# EAGLE design MIDIme V02 (EAGLE 6.6.0)
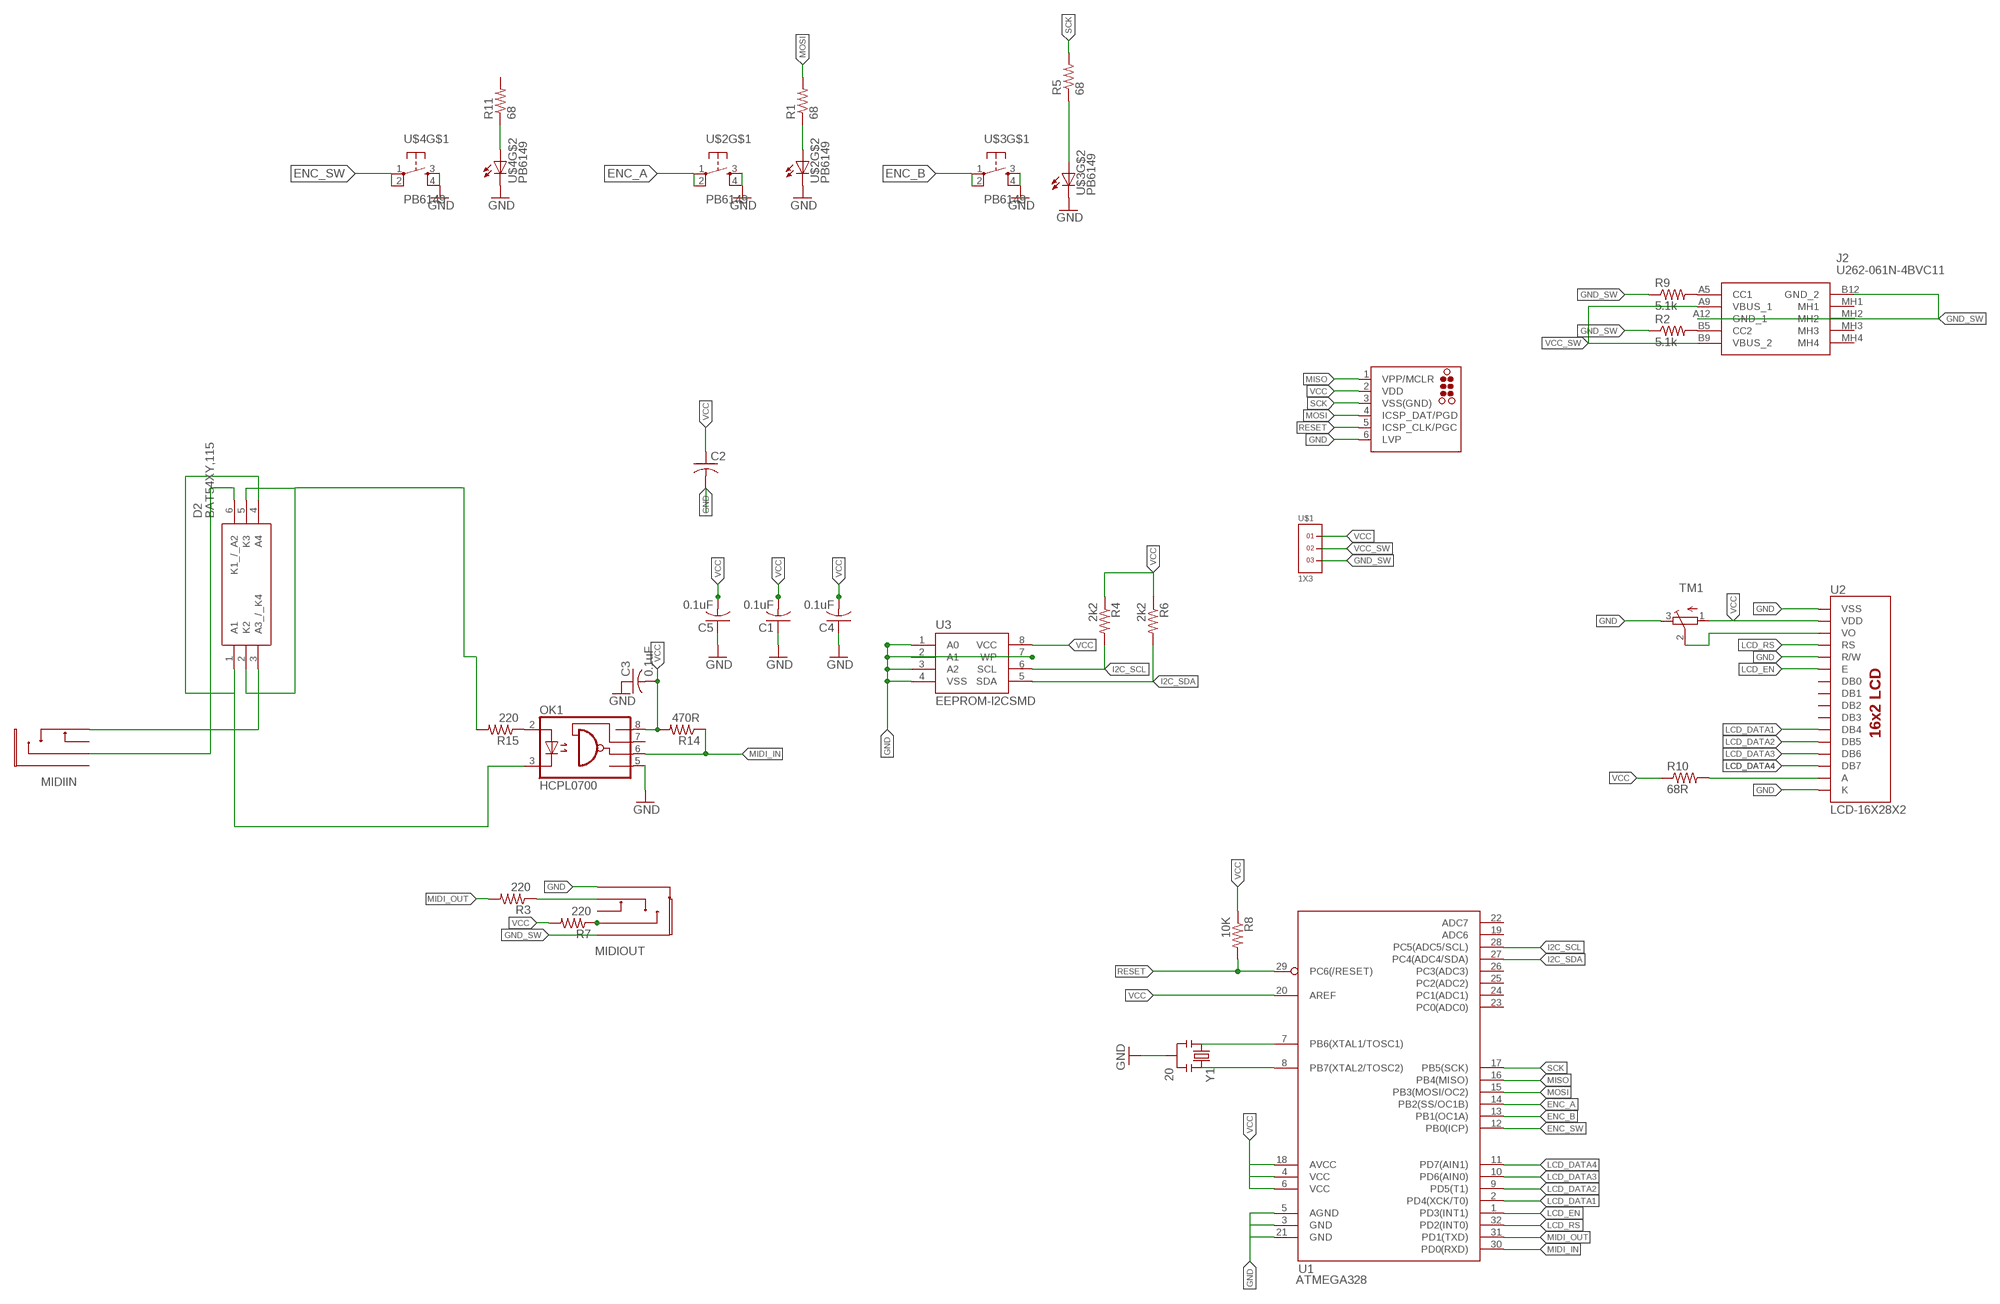
[diagram p0: schematic, sheet 1]

## Parts
C1  0.1uF  RCL_C-USC0402K  [RCL_C0402K]
C2  C-USC0805K  [C0805K]
C3  0.1uF  RCL_C-USC0402K  [RCL_C0402K]
C4  0.1uF  RCL_C-USC0402K  [RCL_C0402K]
C5  0.1uF  RCL_C-USC0402K  [RCL_C0402K]
D2  BAT54XY,115  [SOT65P210X110-6N]
J2  U262-061N-4BVC11  USB4125-GF-A  [USB4125GFA]
J5  TC2030-MCP-NL  [TC2030-MCP-NL]
MIDIIN  PJ327E  [PJ327]
MIDIOUT  PJ327E_GSW  [PJ327A_5A]
OK1  HCPL0700  HCPL0600  [SOIC08]
R1  68  R-US_R0402  [R0402]
R2  5.1k  R-US_R0402  [R0402]
R3  220  RCL_R-US_R0402  [RCL_R0402]
R4  2k2  RCL_R-US_R0402  [RCL_R0402]
R5  68  R-US_R0402  [R0402]
R6  2k2  RCL_R-US_R0402  [RCL_R0402]
R7  220  RCL_R-US_R0402  [RCL_R0402]
R8  10K  RCL_R-US_R0402  [RCL_R0402]
R9  5.1k  R-US_R0402  [R0402]
R10  68R  RCL_R-US_R0402  [RCL_R0402]
R11  68  R-US_R0402  [R0402]
R14  470R  RCL_R-US_R0402  [RCL_R0402]
R15  220  RCL_R-US_R0402  [RCL_R0402]
TM1  TRIMPOTTC33X  [TC33X]
U1  ATMEGA328  [TQFP32-08]
U2  LCD-16X28X2  [LCD-8X2]
U3  EEPROM-I2CSMD  [SO08]
U$1  1X3  [1X3]
U$2  PB6149  [PB6149]
U$3  PB6149  [PB6149]
U$4  PB6149  [PB6149]
Y1  20  RESONATOR16MHZ  [RESONATOR-SMD]

## Nets
ENC_A: U1.14(PB2(SS/OC1B)) U$2.1 U$2.2
ENC_B: U1.13(PB1(OC1A)) U$3.1 U$3.2
ENC_SW: U1.12(PB0(ICP)) U$4.1 U$4.2
GND: C1.1 C2.2 C3.1 C4.1 C5.1 J5.6(LVP) MIDIOUT.P$4 OK1.5(GND) TM1.3(E) U1.3(GND) U1.5(AGND) U1.21(GND) U2.1(VSS) U2.5(R/W) U2.16(K) U3.1(A0) U3.2(A1) U3.3(A2) U3.4(VSS) U3.7(WP) U$2.3 U$2.4 U$2.5(C) U$3.3 U$3.4 U$3.5(C) U$4.3 U$4.4 U$4.5(C) Y1.2
GND_SW: J2.A12(GND_1) J2.B12(GND_2) MIDIOUT.P$1 R2.1 R9.1 U$1.3
I2C_SCL: R4.2 U1.28(PC5(ADC5/SCL)) U3.6(SCL)
I2C_SDA: R6.2 U1.27(PC4(ADC4/SDA)) U3.5(SDA)
LCD_DATA1: U1.2(PD4(XCK/T0)) U2.11(DB4)
LCD_DATA2: U1.9(PD5(T1)) U2.12(DB5)
LCD_DATA3: U1.10(PD6(AIN0)) U2.13(DB6)
LCD_DATA4: U1.11(PD7(AIN1)) U2.14(DB7)
LCD_EN: U1.1(PD3(INT1)) U2.6(E)
LCD_RS: U1.32(PD2(INT0)) U2.4(RS)
MIDI_IN: OK1.6(VO) R14.1 U1.30(PD0(RXD))
MIDI_IN_RING: D2.6(K1_/_A2) MIDIIN.P$3
MIDI_IN_TIP: D2.3(A3_/_K4) MIDIIN.P$2
MIDI_OUT: R3.2 U1.31(PD1(TXD))
MISO: J5.1(VPP/MCLR) U1.16(PB4(MISO))
MOSI: J5.4(ICSP_DAT/PGD) R1.2 U1.15(PB3(MOSI/OC2))
N$1: R5.1 U$3.6(A)
N$2: U1.7(PB6(XTAL1/TOSC1)) Y1.1
N$3: D2.1(A1) D2.4(A4) OK1.3(C)
N$4: J2.B5(CC2) R2.2
N$5: U1.8(PB7(XTAL2/TOSC2)) Y1.3
N$6: J2.A5(CC1) R9.2
N$7: MIDIOUT.P$3 R7.1
N$8: MIDIOUT.P$2 R3.1
N$9: R1.1 U$2.6(A)
N$10: TM1.2(S) U2.3(VO)
N$11: R10.2 U2.15(A)
N$12: R11.1 U$4.6(A)
N$17: OK1.2(A) R15.1
N$19: D2.2(K2) D2.5(K3) R15.2
RESET: J5.5(ICSP_CLK/PGC) R8.2 U1.29(PC6(/RESET))
SCK: J5.3(VSS(GND)) R5.2 U1.17(PB5(SCK))
VCC: C1.2 C2.1 C3.2 C4.2 C5.2 J5.2(VDD) OK1.8(VCC) R4.1 R6.1 R7.2 R8.1 R10.1 R14.2 TM1.1(A) U1.4(VCC) U1.6(VCC) U1.18(AVCC) U1.20(AREF) U2.2(VDD) U3.8(VCC) U$1.1
VCC_SW: J2.A9(VBUS_1) J2.B9(VBUS_2) U$1.2
Unconnected: J2.MH1 J2.MH2 J2.MH3 J2.MH4 MIDIIN.P$1 MIDIIN.P$4 MIDIIN.P$5 MIDIOUT.P$5 OK1.7(VE) R11.2 U1.19(ADC6) U1.22(ADC7) U1.23(PC0(ADC0)) U1.24(PC1(ADC1)) U1.25(PC2(ADC2)) U1.26(PC3(ADC3)) U2.7(DB0) U2.8(DB1) U2.9(DB2) U2.10(DB3)

## Library data of the parts
C1 C3-C5 = ioboard:RCL_C-US: CAPACITOR, American symbol
C2 = rcl:C-US: CAPACITOR, American symbol
D2 = SamacSys_Parts:BAT54XY,115: Nexperia BAT54XY,115 Quad SMT Schottky Diode, 2x Series Pair, 30V 200mA, 6-Pin SOT-363 Source: Datasheet <https://assets.nexperia.com/documents/data-sheet/BAT54XY.pdf>; DESCRIPTION: Nexperia BAT54XY,115 Quad SMT Schottky Diode, 2x Series Pair, 30V 200mA, 6-Pin SOT-363; HEIGHT: 1.1mm; MANUFACTURER_NAME: Nexperia; MANUFACTURER_PART_NUMBER: BAT54XY,115; MOUSER_PART_NUMBER: 771-BAT54XY-T/R; MOUSER_PRICE-STOCK: https://www.mouser.co.uk/ProductDetail/Nexperia/BAT54XY115?qs=me8TqzrmIYV24GB%252BtDdQuA%3D%3D
J2 = USB4125-GF-A:USB4125-GF-A: USB-C (USB TYPE-C) Receptacle Connector 24 (6+18 Dummy) Position Surface Mount, Right Angle; Through Hole Source: Datasheet <https://gct.co/files/drawings/usb4125.pdf?v=f2858e04-a173-4b74-b17f-8f865ddc3728>; DESCRIPTION: USB-C (USB TYPE-C) Receptacle Connector 24 (6+18 Dummy) Position Surface Mount, Right Angle; Through Hole; HEIGHT: 3.41mm; MANUFACTURER_NAME: GCT (GLOBAL CONNECTOR TECHNOLOGY); MANUFACTURER_PART_NUMBER: USB4125-GF-A; MOUSER_PART_NUMBER: 640-USB4125-GF-A; MOUSER_PRICE-STOCK: https://www.mouser.co.uk/ProductDetail/GCT/USB4125-GF-A?qs=KUoIvG%2F9IlaIQ4zBJ6gLeA%3D%3D
J5 = tag-connect:TC2030: TAG-CONNECT ICSP Connector Manufacturer: Tag-Connect <http://www.tag-connect.com> Cable for easy In-Circuit Serial Programming. Designed for Microchip ICD2, suitable for many others. Two variants - one "with legs" (for hands-free fit on PCB) and another "without legs" for quick programming. PAD Description 1 MCLR/Vpp 2 Vdd 3 GND 4 PGD (ISPDAT) 5 PGC (ISPCLK) 6 nc (used for LVP) ©2009 ROFA.cz - modified and updated by Robert Darlington ‹rdarlington@gmail.com›
MIDIIN = 0Raph's Lib:PJ327E
MIDIOUT = 0Raph's Lib:PJ327E_GSW
OK1 = optocoupler-2:HCPL0600: HEWLETT PACKARD OPTO COUPLER
R1 R2 R5 R9 R11 = rcl:R-US_: RESISTOR, American symbol
R3 R4 R6-R8 R10 R14 R15 = warps_v30:RCL_R-US_: RESISTOR, American symbol
TM1 = adafruit:TRIMPOT: SMT trimmer potentiometer part number TC33X http://www.ladyada.net/library/eagle
U1 = ModernDevice:ATMEGA328
U2 = SparkFun-Displays:LCD-16X2: Standard text-only 16x2 parallel input LCD
U3 = SparkFun-DigitalIC:EEPROM-I2C: I2C EEPROM chips, 24LC256 (and others)
U$1 = headers(2mm):1X3
U$2-U$4 = 0Raph's Lib:PB6149
Y1 = SparkFun-FreqCtrl:RESONATOR: Resonator Small SMD resonator. Used, eg, on the Arduino Pro/ Pro Mini boards. 8MHz- XTAL-08895 16MHz- XTAL-08900; PROD_ID: XTAL-08900; VALUE: 16MHz

## Board
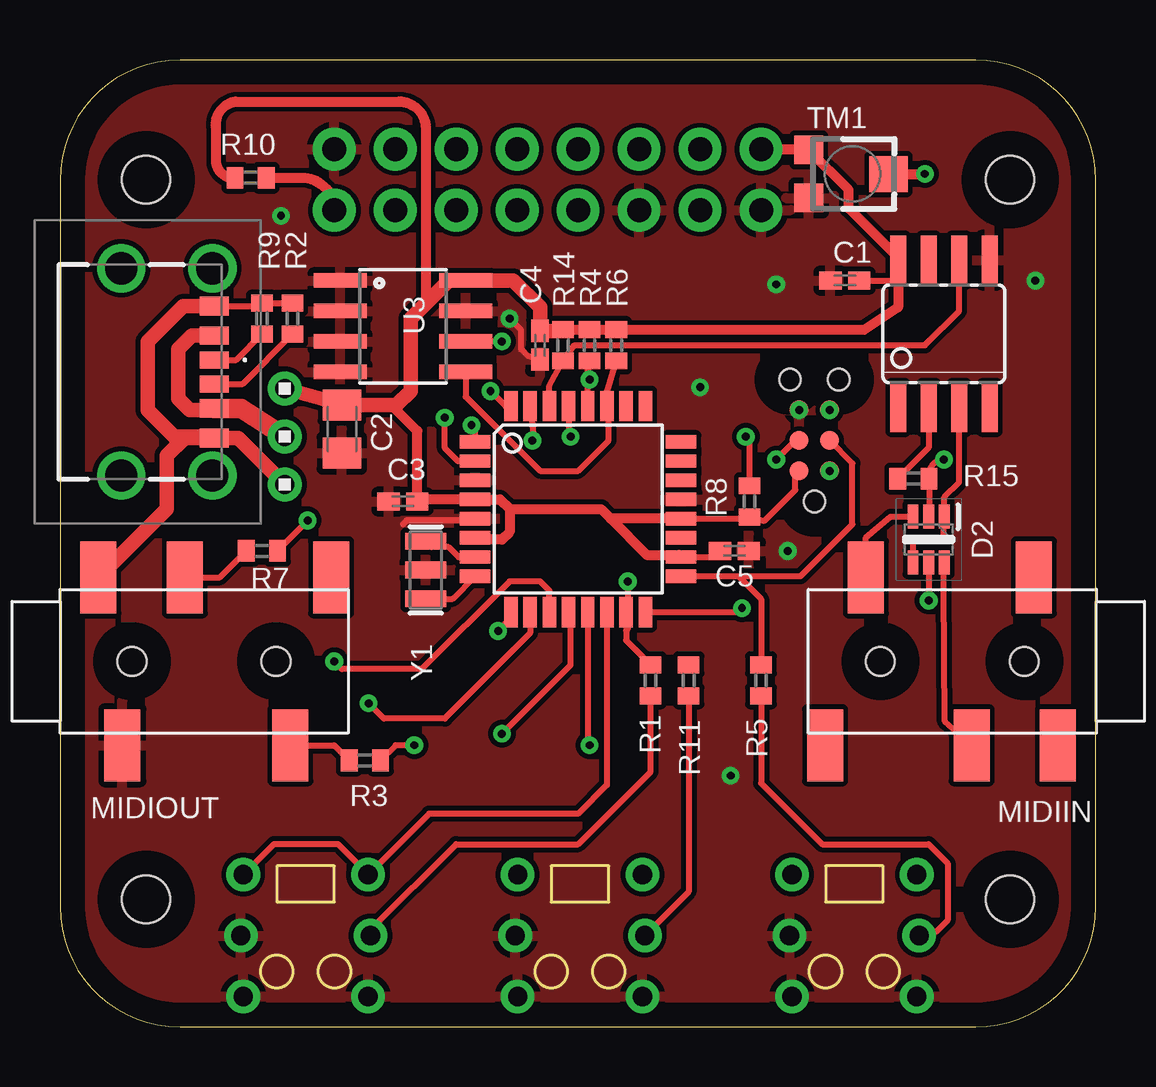
[diagram p1: board, top side]
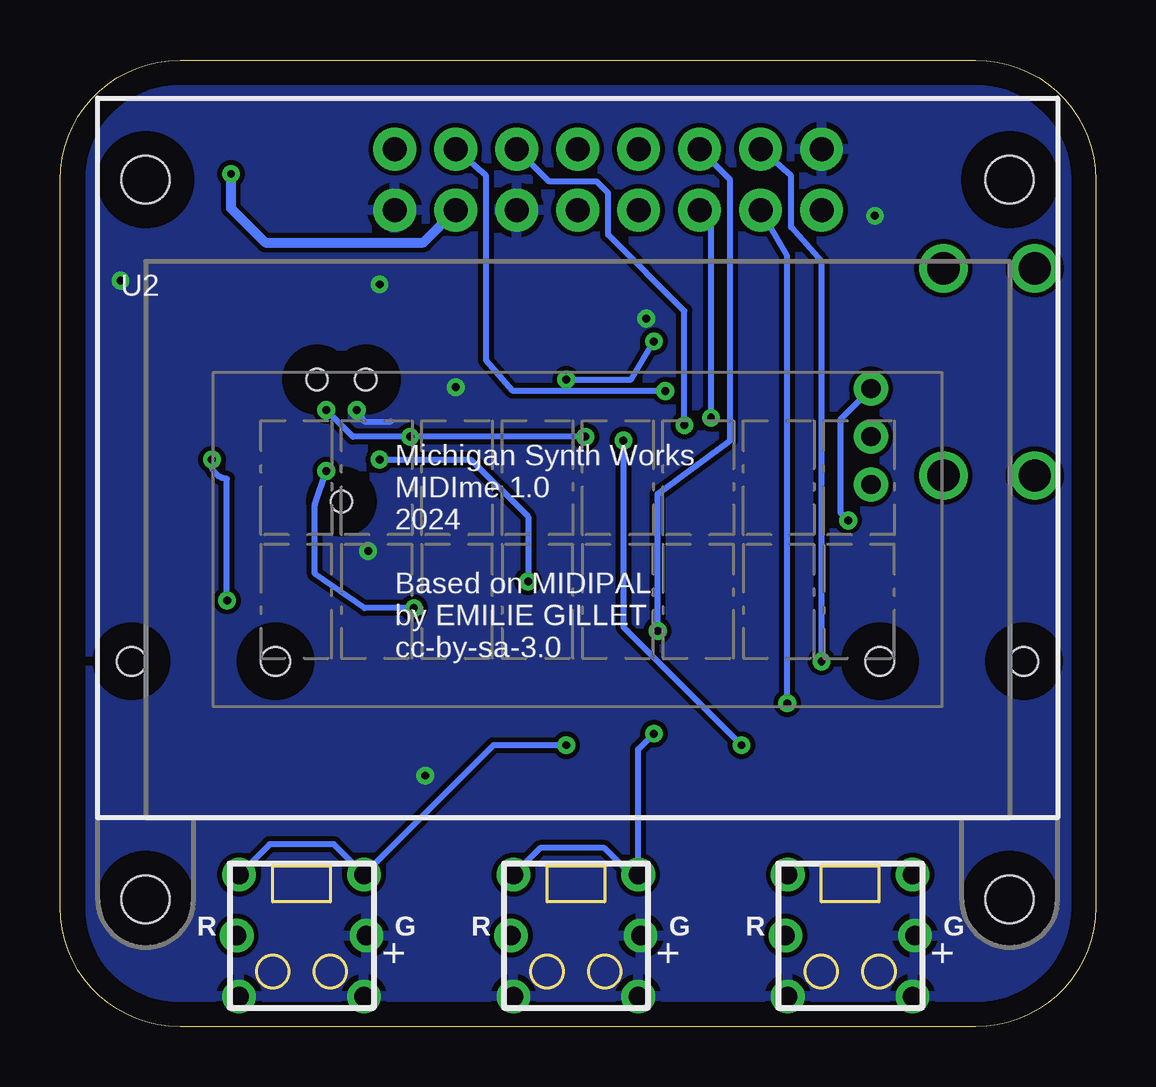
[diagram p2: board, bottom side, seen from below]

Size 43.16 x 40.31 mm. Coordinates in mm from the lower left corner, seen from the top.
Outline: 0,35.31 0,5 arc90 5,0 38.16,0 arc90 43.16,5 43.16,35.31 arc90 38.16,40.31 5,40.31 arc90 0,35.31
Copper layers (1*16): Top 0.035mm / dielectric 1.5mm / Bottom 0.035mm
Design rules "default": minimum track width 10mil, minimum drill 24mil, track to track 8mil, track to pad 8mil, pad to pad 8mil, via to via 8mil, smd to smd 8mil, copper to edge 40mil, drill to drill 8mil, minimum pad ring 10mil, minimum via ring 8mil, stop-mask expansion 4mil, vias tented up to drill 25mil, thermal gap 10mil

### Footprints (pad centres in the part's own frame; a part is rotated, then mirrored left to right if it is on the bottom)
RCL_C0402K = smd 0.925 x 0.74: 1 -0.6,0; 2 0.6,0
C0805K = smd 1.3 x 1.6: 1 -1,0; 2 1,0
SOT65P210X110-6N = smd 1 x 0.45: 1 -0.95,0.65; 2 -0.95,0; 3 -0.95,-0.65; 4 0.95,-0.65; 5 0.95,0; 6 0.95,0.65
USB4125GFA = smd 0.7 x 1.2: A5 -0.5,2.778; B5 0.5,2.778 | smd 0.76 x 1.2: A9 1.52,2.778; B9 -1.52,2.778 | smd 0.8 x 1.2: A12 2.75,2.778; B12 -2.75,2.778 | drill 1.34 pad 2.01: MH1 4.32,2.698; MH2 4.32,-1.102; MH3 -4.32,-1.102; MH4 -4.32,2.698
TC2030-MCP-NL = smd 0.787 x 0.787: 1 1.27,-0.635; 2 1.27,0.635; 3 2.54,-0.635; 4 2.54,0.635; 5 3.81,-0.635; 6 3.81,0.635 | hole 0.889: 0,0; 5.08,-1.016; 5.08,1.016
PJ327 = smd 1.5 x 3: P$1 1.6,3.5; P$2 9.6,-3.5; P$3 5.2,3.5; P$4 2.6,-3.5; P$5 11.3,3.5 | hole 1.2: 3,0; 9,0
PJ327A_5A = smd 1.5 x 3: P$1 1.6,3.5; P$2 9.6,-3.5; P$3 5.2,3.5; P$4 2.6,-3.5; P$5 11.3,3.5 | hole 1.2: 3,0; 9,0
SOIC08 = smd 0.66 x 2.032: 1 -1.905,-3.073; 2 -0.635,-3.073; 3 0.635,-3.073; 4 1.905,-3.073; 5 1.905,3.073; 6 0.635,3.073; 7 -0.635,3.073; 8 -1.905,3.073
R0402 = smd 0.7 x 0.9: 1 -0.65,0; 2 0.65,0
RCL_R0402 = smd 0.7 x 0.9: 1 -0.65,0; 2 0.65,0
TC33X = smd 1.2 x 1.2: 1 -1,-1.825; 3 1,-1.825 | smd 1.5 x 1.6: 2 0,1.5
TQFP32-08 = smd 1.27 x 0.559: 1 -4.293,2.8; 2 -4.293,2; 3 -4.293,1.2; 4 -4.293,0.4; 5 -4.293,-0.4; 6 -4.293,-1.2; 7 -4.293,-2; 8 -4.293,-2.8; 17 4.293,-2.8; 18 4.293,-2; 19 4.293,-1.2; 20 4.293,-0.4; 21 4.293,0.4; 22 4.293,1.2; 23 4.293,2; 24 4.293,2.8 | smd 0.559 x 1.27: 9 -2.8,-4.293; 10 -2,-4.293; 11 -1.2,-4.293; 12 -0.4,-4.293; 13 0.4,-4.293; 14 1.2,-4.293; 15 2,-4.293; 16 2.8,-4.293; 25 2.8,4.293; 26 2,4.293; 27 1.2,4.293; 28 0.4,4.293; 29 -0.4,4.293; 30 -1.2,4.293; 31 -2,4.293; 32 -2.8,4.293
LCD-8X2 = drill 1 pad 1.778: 1 -7.62,13.73; 2 -7.62,16.27; 3 -5.08,13.73; 4 -5.08,16.27; 5 -2.54,13.73; 6 -2.54,16.27; 7 0,13.73; 8 0,16.27; 9 2.54,13.73; 10 2.54,16.27; 11 5.08,13.73; 12 5.08,16.27; 13 7.62,13.73; 14 7.62,16.27; 15 10.16,13.73; 16 10.16,16.27 | hole 2: 18,15; -18,15; -18,-15; 18,-15
SO08 = smd 0.61 x 2.21: 1 -1.905,-2.616; 2 -0.635,-2.616; 3 0.635,-2.616; 4 1.905,-2.616; 5 1.905,2.616; 6 0.635,2.616; 7 -0.635,2.616; 8 -1.905,2.616
1X3 = drill 0.8 pad 1.422: 1 -2,0; 2 0,0; 3 2,0
PB6149 = drill 0.8 pad 1.4: 1 2.523,2.54; 2 -2.677,2.54; 3 2.523,-2.54; 4 -2.677,-2.54; 5 2.623,0; 6 -2.777,0
RESONATOR-SMD = smd 0.7 x 1.7: 1 -1.2,0; 2 0,0; 3 1.2,0

### Placement (x,y rotation side)
C1  32.7,31.11 0 top
C2  11.75,24.92 270 top
C3  14.29,21.91 0 top
C4  20,28.42 90 top
C5  28.1,19.84 180 top
D2  36.2,20.32 270 top
J2  3.65,27.3 270 top
J5  31.43,21.91 90 top
MIDIIN  43.18,15.24 180 top
MIDIOUT  0,15.24 0 top
OK1  36.83,28.89 0 top
R1  24.61,14.45 90 top
R2  9.68,29.53 270 top
R3  12.7,11.11 0 top
R4  22.07,28.42 270 top
R5  29.21,14.45 90 top
R6  23.18,28.42 270 top
R7  8.41,19.84 0 top
R8  28.73,21.91 90 top
R9  8.41,29.53 270 top
R10  7.94,35.4 0 top
R11  26.19,14.45 90 top
R14  20.95,28.42 90 top
R15  35.56,22.86 0 top
TM1  33.02,35.56 270 top
U1  21.59,21.59 0 top
U2  21.59,20.32 0 bottom
U3  14.29,29.21 270 top
U$1  9.37,24.61 270 top
U$2  10.16,3.81 0 bottom
U$3  33.02,3.81 0 bottom
U$4  21.59,3.81 0 bottom
Y1  15.24,19.05 270 top

### Tracks (layer width: path | path; a pad name or v marks a point on that pad's centre or on a via)
ENC_A
  Top 0.254: U1.14 22.79,10.09 21.59,8.89 15.38,8.89 U$2.2 12.84,6.37 11.59,7.62 8.91,7.62 U$2.1
ENC_B  (via drill 0.33)
  Top 0.254: U1.13 21.99,11.82 v22.07,11.75
  Bottom 0.254: v22.07,11.75 25.1,11.75 U$3.1 30.5,6.37 31.75,7.62 34.43,7.62 U$3.2
ENC_SW  (via drill 0.33)
  Top 0.254: v18.41,12.22 21.27,15.08 21.27,17.21 U1.12
  Bottom 0.254: 18.34,12.15 v18.41,12.22 19.07,11.57 U$4.1 19.37,6.35 20.48,7.46 23.16,7.46 U$4.2
GND  (via drill 0.33)
  Top 0.254: U1.5 16.75,21.19 16.67,21.11 14.45,21.11 14.29,20.95 | C4.1 19.49,27.98 19.21,28.26 19.21,29.05 v18.73,29.53
  Bottom 0.254: J5.6 30.48,25.24 29.37,25.24
  other vias: 26.67,26.67 27.94,10.48 30.8,25.72 30.32,19.84 9.21,33.81 29.84,30.96 40.64,31.11
  pour Top: -0.64,40.64 43.18,40.01 43.81,0 4.37,0 arc-90 -0.64,5
  pour Bottom: -1.27,-1.27 -1.27,41.91 41.91,41.91 41.91,-1.27
GND_SW
  Top 0.254: J2.B12 8.29,30.05 R9.1 R2.1
  Top 0.61: J2.B12 5.13,30.05 3.65,28.57 3.65,25.72 4.76,24.61 6.38,24.61 J2.A12 | J2.A12 5.19,24.55 4.45,23.81 4.45,21.59 MIDIOUT.P$1 | J2.A12 7.42,24.55 U$1.3
I2C_SCL  (via drill 0.33)
  Top 0.254: U1.28 21.99,27.69 | 21.99,27.69 R4.2 | 21.99,27.69 21.98,27.69 v22.07,26.99 | v18.41,28.57 U3.6
  Bottom 0.254: v22.07,26.99 19.37,26.99 v18.41,28.57
I2C_SDA
  Top 0.254: U3.5 16.9,26.28 20,23.18 21.59,23.18 22.86,24.45 22.86,25.81 U1.27 22.79,26.43 R6.2
LCD_DATA1  (via drill 0.33)
  Top 0.254: U1.2 16.57,23.59 16.03,24.13 v16.03,25.4
  Bottom 0.254: v16.03,25.4 16.03,33.41 U2.11
LCD_DATA2  (via drill 0.33)
  Top 0.254: U1.9 18.79,17.04 v18.26,16.51
  Bottom 0.254: v18.26,16.51 18.26,22.23 15.24,24.45 15.24,35.32 U2.12
LCD_DATA3  (via drill 0.33)
  Top 0.254: U1.10 19.59,16.41 16.03,12.86 13.49,12.86 v12.86,13.49
  Bottom 0.254: v12.86,13.49 12.86,32.15 U2.13
LCD_DATA4  (via drill 0.33)
  Top 0.254: U1.11 20.39,18.19 20,18.57 18.73,18.57 15.08,14.92 11.75,14.92 v11.43,15.24
  Bottom 0.254: v11.43,15.24 11.43,31.91 12.7,33.34 12.7,35.48 U2.14
LCD_EN  (via drill 0.33)
  Top 0.254: U1.1 17.3,24.93 v17.14,25.08
  Bottom 0.254: v17.14,25.08 17.14,29.84 20.32,33.02 20.32,34.77 20.8,35.24 22.78,35.24 U2.6
LCD_RS  (via drill 0.33)
  Top 0.254: U1.32 18.57,25.88 v17.94,26.51
  Bottom 0.254: v17.94,26.51 24.29,26.51 25.4,27.78 25.4,35.48 U2.4
MIDI_IN
  Top 0.254: U1.30 20.39,26.74 R14.1 21.43,28.42 36.04,28.42 37.47,29.84 OK1.6
MIDI_IN_RING
  Top 0.254: MIDIIN.P$3 36.87,12.74 36.83,18.26 36.83,19.36 D2.6
MIDI_IN_TIP
  Top 0.254: MIDIIN.P$2 33.58,20.4 34.61,21.27 D2.3
MIDI_OUT  (via drill 0.33)
  Top 0.254: U1.31 19.75,24.51 v19.68,24.45 | v14.76,11.75 13.98,11.75 R3.2
  Bottom 0.254: v19.68,24.45 19.68,16.67 v14.76,11.75
MISO  (via drill 0.33)
  Top 0.254: U1.16 28.25,17.3 v28.42,17.46 | 32.23,23.18 J5.1
  Bottom 0.254: v28.42,17.46 30.48,17.46 32.54,18.89 32.54,21.75 J5.1
  other vias: 32.07,23.18
MOSI  (via drill 0.33)
  Top 0.254: U1.15 23.59,16.51 | 23.59,16.51 23.59,16.11 R1.2 | J5.4 30.64,24.45 v29.84,23.65 | v23.65,18.57 23.65,16.57 23.59,16.51
  Bottom 0.254: v29.84,23.65 26.04,23.65 23.65,21.27 v23.65,18.57
N$1
  Top 0.254: R5.1 29.21,10.16 31.75,7.62 36.2,7.62 36.99,6.83 36.99,4.45 36.51,3.97 35.96,3.97 U$3.6
N$2
  Top 0.254: U1.7 16.61,19.59 16.19,20 15.49,20 Y1.1
N$3
  Top 0.254: D2.4 35.55,20.3 35.56,20.32 36.83,20.32 36.83,21.25 D2.1 36.84,22.08 37.47,22.7 OK1.3
N$4
  Top 0.254: J2.B5 7.61,26.8 R2.2
N$5
  Top 0.254: Y1.3 16.36,17.85 U1.8
N$6
  Top 0.254: J2.A5 7.34,27.8 R9.2
N$7
  Top 0.254: MIDIOUT.P$3 6.66,18.74 R7.1
N$8
  Top 0.254: MIDIOUT.P$2 11.42,11.74 R3.1
N$9
  Top 0.254: U$2.6 12.94,4.05 16.51,7.62 21.59,7.62 24.61,10.64 R1.1
N$10  (via drill 0.33)
  Top 0.406: TM1.2 v36.04,35.56
  Bottom 0.406: v36.04,35.56 36.04,34.13 34.61,32.7 28.02,32.7 U2.3
N$11
  Top 0.406: R10.2 10.08,35.4 arc-90 U2.15
N$12
  Top 0.254: R11.1 26.19,5.64 U$4.6
N$17
  Top 0.254: OK1.2 36.2,24.14 R15.1
N$19  (via drill 0.33)
  Top 0.254: D2.2 36.21,21.29 R15.2 36.21,23.03 arc-90 v36.83,23.65 | D2.5 v36.2,17.78
  Bottom 0.254: v36.2,17.78 arc90 36.21,17.8 R15.2 arc90 36.83,23.48 v36.83,23.65
RESET  (via drill 0.33)
  Top 0.254: U1.29 21.19,24.69 v21.27,24.61 | R8.2 28.73,24.45 v28.57,24.61 | J5.5 32.07,25.88
  Bottom 0.254: v21.27,24.61 v28.57,24.61 30.96,24.61 J5.5
  other vias: 32.07,25.72
SCK
  Top 0.254: U1.17 28.26,18.79 | 28.26,18.79 30.86,18.79 33.02,20.95 33.02,23.5 J5.3 | 28.26,18.79 29.21,17.84 R5.2
VCC  (via drill 0.33)
  Top 0.254: 31.16,36.59 TM1.1 | 17.37,20.32 U1.6 | R7.2 9.06,20.02 9.22,20.02 v10.32,21.11 | 25.79,19.68 U1.18 27.25,19.59 C5.2 | U1.20 28.64,21.19 R8.1 29.35,21.1 30.64,22.38 30.64,23.02 J5.2 | C1.2 34.87,31.11 OK1.8
  Top 0.406: U2.2 31.16,36.59 | 18.73,21.59 18.33,21.99 U1.4 14.97,21.99 C3.2 14.89,24.85 13.81,25.92 | 18.73,21.59 18.73,20.64 18.41,20.32 17.37,20.32 | 18.73,21.59 22.54,21.59 22.94,21.19 | 22.94,21.19 24.45,19.68 25.79,19.68 | U1.20 22.94,21.19 | U3.8 16.19,31.11 | R14.2 R4.1 R6.1 23.64,29.05 33.5,29.05 34.92,30 OK1.8 34.92,32.07 32.86,34.13 32.86,34.89 TM1.1 | R10.1 arc-90 6.51,36.02 6.51,37.47 arc-90 7.3,38.58 14.13,38.58 arc-90 15.24,37.47 15.24,30.16
  Top 0.61: U$1.1 11.7,25.97 C2.1 13.81,25.92 14.02,25.92 14.61,26.51 14.61,29.53 15.24,30.16 16.19,31.11 | U3.8 18.89,31.11 20,30 C4.2 20.85,29.02 R14.2
  Bottom 0.254: v10.32,21.11 10.64,21.43 10.64,25.34 U$1.1
VCC_SW
  Top 0.61: J2.B9 5.49,28.82 4.92,28.26 4.92,26.19 5.4,25.72 6.36,25.72 J2.A9
  Top 0.813: J2.A9 7.55,25.79 U$1.2

### Text on the board
bPlace: Michigan Synth Works / MIDIme 1.0 / 2024 / / Based on MIDIPAL / by EMILIE GILLET / cc-by-sa-3.0